# EAGLE design waterius-homemade_heat_counter (EAGLE 9.6.2)
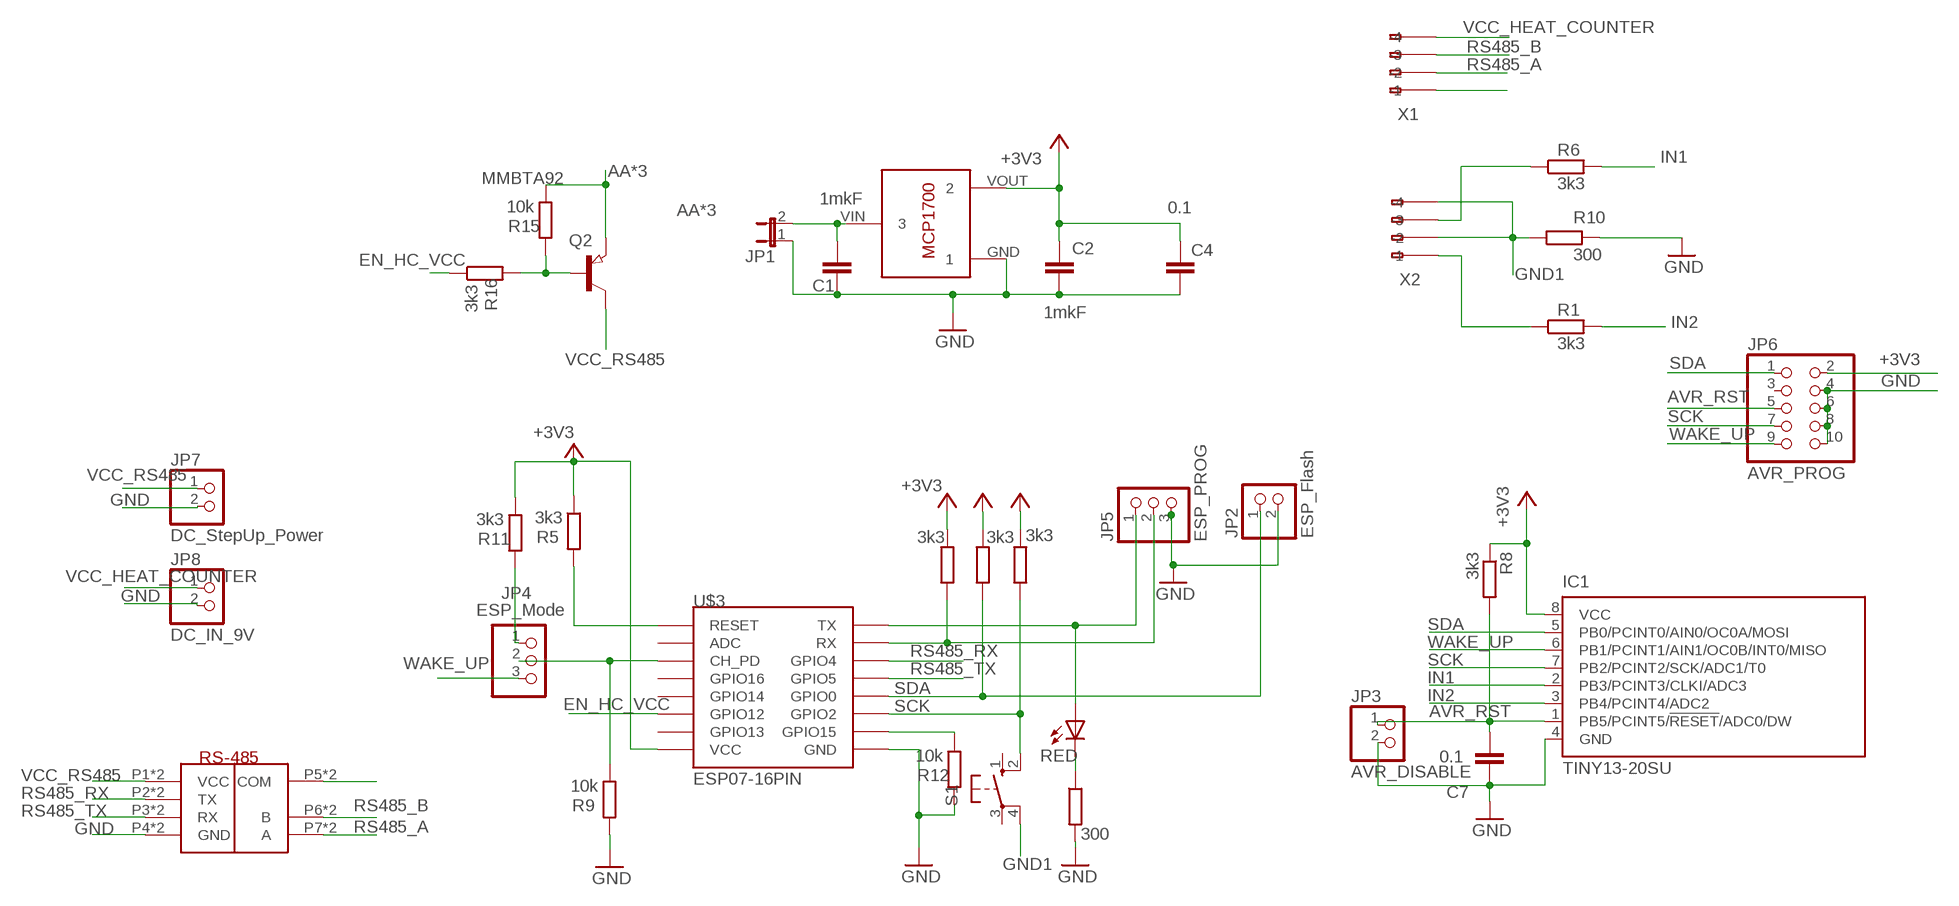
[diagram p0: schematic, sheet 1]

## Parts
C1  1mkF  C-EUC0805  [C0805]
C2  1mkF  C-EUC0805  [C0805]
C4  0.1  C-EUC0805  [C0805]
C7  0.1  C-EUC0805  [C0805]
IC1  TINY13-20SU  [8S2]
JP1  JP1E  [JP1]
JP2  ESP_Flash  PINHD-1X2  [1X02]
JP3  AVR_DISABLE  PINHD-1X2  [1X02]
JP4  ESP_Mode  PINHD-1X3  [1X03]
JP5  ESP_PROG  PINHD-1X3  [1X03]
JP6  AVR_PROG  PINHD-2X5  [2X05]
JP7  DC_StepUp_Power  PINHD-1X2  [1X02]
JP8  DC_IN_9V  PINHD-1X2  [1X02]
LED1  RED  LEDCHIPLED_0805  [CHIPLED_0805]
Q2  MMBTA92  PNP-TRANSISTOR_SOT23  [SOT23]
R1  3k3  R-EU_M0805  [M0805]
R2  3k3  R-EU_R0805  [R0805]
R3  3k3  R-EU_R0805  [R0805]
R4  300  R-EU_R0805  [R0805]
R5  3k3  R-EU_R0805  [R0805]
R6  3k3  R-EU_M0805  [M0805]
R7  3k3  R-EU_R0805  [R0805]
R8  3k3  R-EU_R0805  [R0805]
R9  10k  R-EU_R0805  [R0805]
R10  300  R-EU_M0805  [M0805]
R11  3k3  R-EU_R0805  [R0805]
R12  10k  R-EU_R0805  [R0805]
R15  10k  R-EU_R0805  [R0805]
R16  3k3  R-EU_R0805  [R0805]
S1  10-XX  [B3F-10XX]
U1  RS-485-MODULE  [DIP_MODULE]
U$2  MCP1700T-3302E/TT  [MCP1700T-3302E/TT]
U$3  ESP07-16PIN  [ESP07-16PIN]
X1  233-104  [233-104]
X2  233-104  [233-104]

## Nets
+3V3: C2.1 C4.1 IC1.8(VCC) JP6.2 R2.1 R3.1 R5.1 R7.1 R8.1 R11.1 U$2.VOUT U$3.VCC
AA*3: C1.1 JP1.2 Q2.2(E) R15.1 U$2.VIN
AVR_RST: C7.2 IC1.1(PB5/PCINT5/!RESET!/ADC0/DW) JP3.1 JP6.5 R8.2
EN_HC_VCC: R16.1 U$3.GPIO12
GND: C1.2 C2.2 C4.2 C7.1 IC1.4(GND) JP1.1 JP2.2 JP3.2 JP5.3 JP6.4 JP6.6 JP6.8 JP6.10 JP7.2 JP8.2 R4.2 R9.2 R10.2 R12.2 U1.P4(GND) U1.P13(GND) U$2.GND U$3.GND
GND1: R10.1 S1.4(P1) X2.A2(-2) X2.A4(-4)
IN1: IC1.2(PB3/PCINT3/CLKI/ADC3) R6.2
IN2: IC1.3(PB4/PCINT4/ADC2) R1.2
N$1: JP5.1 LED1.A U$3.TX
N$2: R5.2 U$3.REST(RESET)
N$3: R6.1 X2.A3(-3)
N$4: R1.1 X2.A1(-1)
N$5: JP5.2 R7.2 U$3.RX
N$6: LED1.C R4.1
N$7: JP4.2 R9.1 U$3.CH_PD
N$8: JP4.1 R11.2
N$9: R12.1 U$3.GPIO15
N$13: Q2.1(B) R15.2 R16.2
N$15: X1.A1(-1)
N$16: U1.P5(COM) U1.P14(COM)
RS485_A: U1.P7(A) U1.P8(A) X1.A2(-2)
RS485_B: U1.P6(B) U1.P9(B) X1.A3(-3)
RS485_RX: U1.P2(TX) U1.P11(TX) U$3.GPIO4
RS485_TX: U1.P3(RX) U1.P12(RX) U$3.GPIO5
SCK: IC1.7(PB2/PCINT2/SCK/ADC1/T0) JP6.7 R2.2 S1.2(S1) U$3.GPIO2
SDA: IC1.5(PB0/PCINT0/AIN0/OC0A/MOSI) JP2.1 JP6.1 R3.2 U$3.GPIO0
VCC_HEAT_COUNTER: JP8.1 X1.A4(-4)
VCC_RS485: JP7.1 Q2.3(C) U1.P1(VCC) U1.P10(VCC)
WAKE_UP: IC1.6(PB1/PCINT1/AIN1/OC0B/INT0/MISO) JP4.3 JP6.9
Unconnected: JP6.3 S1.1(S) S1.3(P) U$3.ADC U$3.GPIO13 U$3.GPIO14 U$3.GPIO16 X1.B1(B-1) X1.B2(B-2) X1.B3(B-3) X1.B4(B-4) X2.B1(B-1) X2.B2(B-2) X2.B3(B-3) X2.B4(B-4)

## Library data of the parts
C1 C2 C7 = resistor:C-EU: CAPACITOR, European symbol
C4 = rcl:C-EU: CAPACITOR, European symbol; SPICEPREFIX: C
IC1 = atmel:TINY13: 8-bit AVR Microcontroller with 1K Bytes In-System Programmable Flash Source: http://www.atmel.com/dyn/resources/prod_documents/2535S.pdf; MPN: ATTINY13-20SU; OC_FARNELL: 9171568; OC_NEWARK: 96K6522
JP1 = jumper:JP1E: JUMPER
JP2 JP3 JP7 JP8 = pinhead:PINHD-1X2: PIN HEADER
JP4 JP5 = pinhead:PINHD-1X3: PIN HEADER
JP6 = pinhead:PINHD-2X5: PIN HEADER
LED1 = led:LED: LED OSRAM: - CHIPLED LG R971, LG N971, LY N971, LG Q971, LY Q971, LO R971, LY R971 LH N974, LH R974 LS Q976, LO Q976, LY Q976 LO Q996 - Hyper CHIPLED LW Q18S LB Q993, LB Q99A, LB R99A - SideLED LS A670, LO A670, LY A670, LG A670, LP A670 LB A673, LV A673, LT A673, LW A673 LH A674 LY A675 LS A676, LA A676, LO A676, LY A676, LW A676 LS A679, LY A679, LG A679 - Hyper Micro SIDELED® LS Y876, LA Y876, LO Y876, LY Y876 LT Y87S - SmartLED LW L88C, LW L88S LB L89C, LB L89S, LG L890 LS L89K, LO L89K, LY L89K LS L896, LA L896, LO L896, LY L896 - TOPLED LS T670, LO T670, LY T670, LG T670, LP T670 LSG T670, LSP T670, LSY T670, LOP T670, LYG T670 LG T671, LOG T671, LSG T671 LB T673, LV T673, LT T673, LW T673 LH T674 LS T676, LA T676, LO T676, LY T676, LB T676, LH T676, LSB T676, LW T676 LB T67C, LV T67C, LT T67C, LS T67K, LO T67K, LY T67K, LW E67C LS E67B, LA E67B, LO E67B, LY E67B, LB E67C, LV E67C, LT E67C LW T67C LS T679, LY T679, LG T679 LS T770, LO T770, LY T770, LG T770, LP T770 LB T773, LV T773, LT T773, LW T773 LH T774 LS E675, LA E675, LY E675, LS T675 LS T776, LA T776, LO T776, LY T776, LB T776 LHGB T686 LT T68C, LB T68C - Hyper Mini TOPLED® LB M676 - Mini TOPLED Santana® LG M470 LS M47K, LO M47K, LY M47K Source: http://www.osram.convergy.de LUXEON: - LUMILED® LXK2-PW12-R00, LXK2-PW12-S00, LXK2-PW14-U00, LXK2-PW14-V00 LXK2-PM12-R00, LXK2-PM12-S00, LXK2-PM14-U00 LXK2-PE12-Q00, LXK2-PE12-R00, LXK2-PE12-S00, LXK2-PE14-T00, LXK2-PE14-U00 LXK2-PB12-K00, LXK2-PB12-L00, LXK2-PB12-M00, LXK2-PB14-N00, LXK2-PB14-P00, LXK2-PB14-Q00 LXK2-PR12-L00, LXK2-PR12-M00, LXK2-PR14-Q00, LXK2-PR14-R00 LXK2-PD12-Q00, LXK2-PD12-R00, LXK2-PD12-S00 LXK2-PH12-R00, LXK2-PH12-S00 LXK2-PL12-P00, LXK2-PL12-Q00, LXK2-PL12-R00 Source: www.luxeon.com KINGBRIGHT: KA-3528ASYC Source: www.kingbright.com
Q2 = semicon-smd-ipc:PNP-TRANSISTOR_: PNP TRANSISTOR
R1 = resistor:R-EU_: RESISTOR, European symbol; SPICEPREFIX: R
R2 R5 R7 R9 R11 R12 R15 R16 = rcl:R-EU_: RESISTOR, European symbol; OM: 3k6
R3 R8 = rcl:R-EU_: RESISTOR, European symbol; OM: 3k6; SPICEPREFIX: R
R4 = rcl:R-EU_: RESISTOR, European symbol; OM: 200; SPICEPREFIX: R
R6 R10 = resistor:R-EU_: RESISTOR, European symbol
S1 = switch-omron:10-XX: OMRON SWITCH; MPN: B3F-1000; OC_FARNELL: 176432; OC_NEWARK: 36M3542
U1 = RS485Module:RS-485-MODULE
U$2 = MCP1700T-3302E_TT:MCP1700T-3302E/TT: Microchip LDO "MCP1700" in a 3-Pin SOT-23 package. ID: MCP1700T-3302E/TT
U$3 = esp8266modules:ESP07-16PIN: ESP8266 Wifi module 07 - 16 pins; DIMENSIONS: 22.0 x 16.0 mm; PINS: 16; PITCH: 0.078" / 2 mm
X1 X2 = con-wago255:233-104: WAGO; MPN: 233-104; OC_FARNELL: unknown; OC_NEWARK: 28K9046

## Board
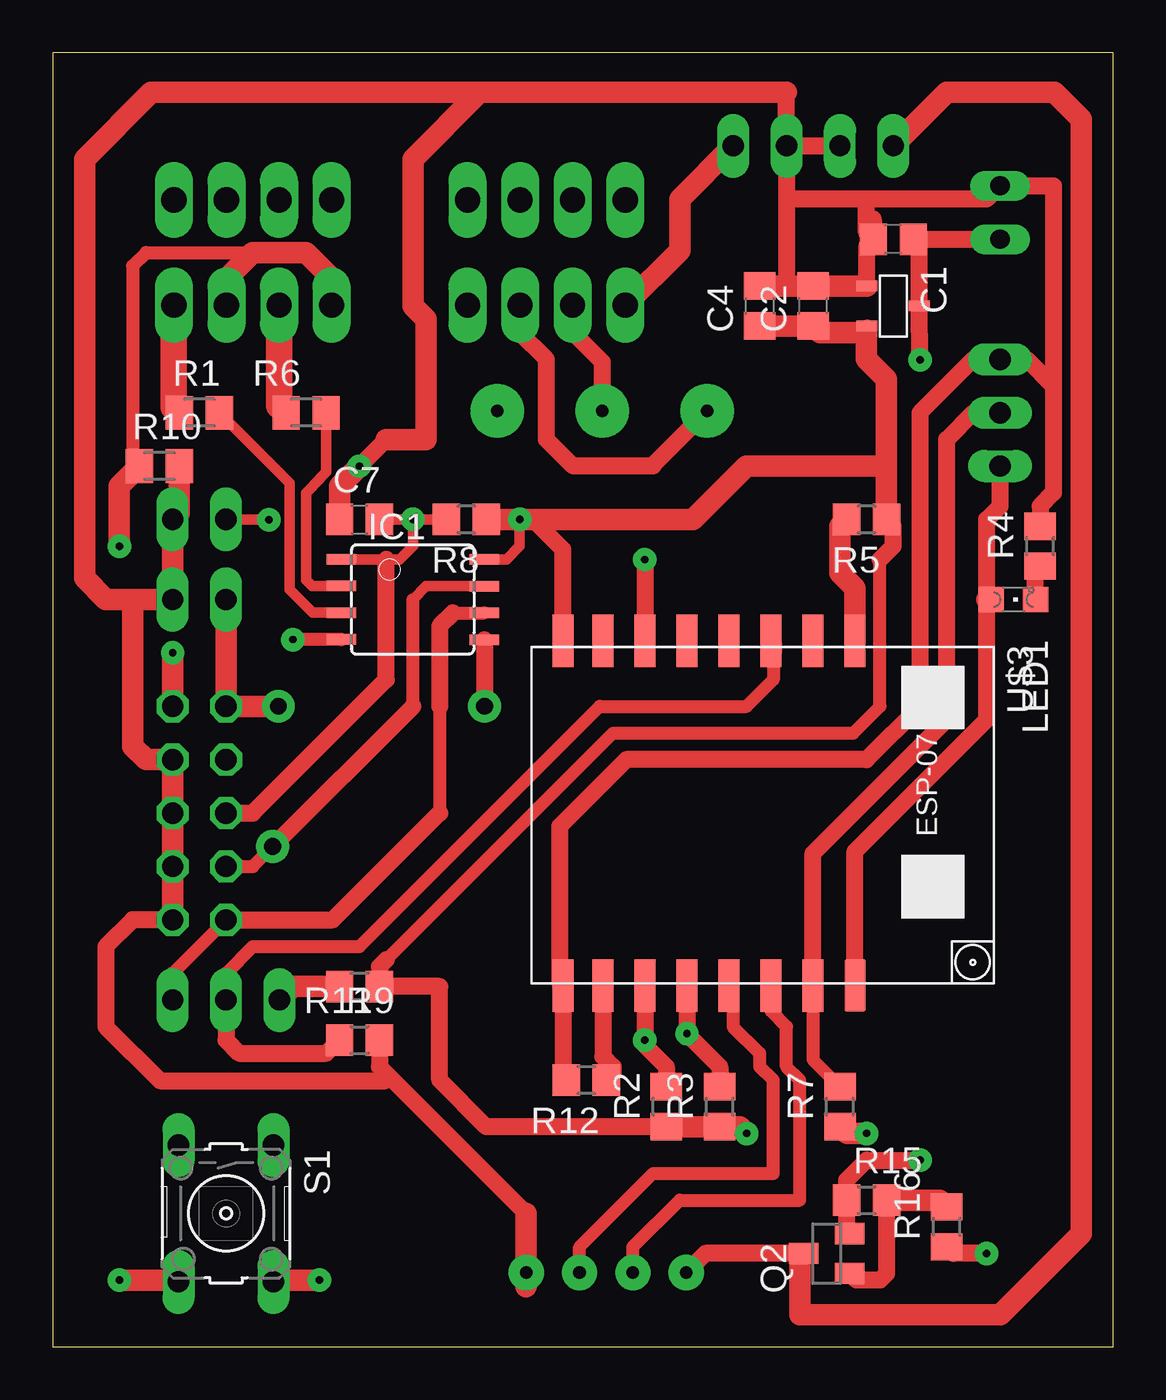
[diagram p1: board, top side]
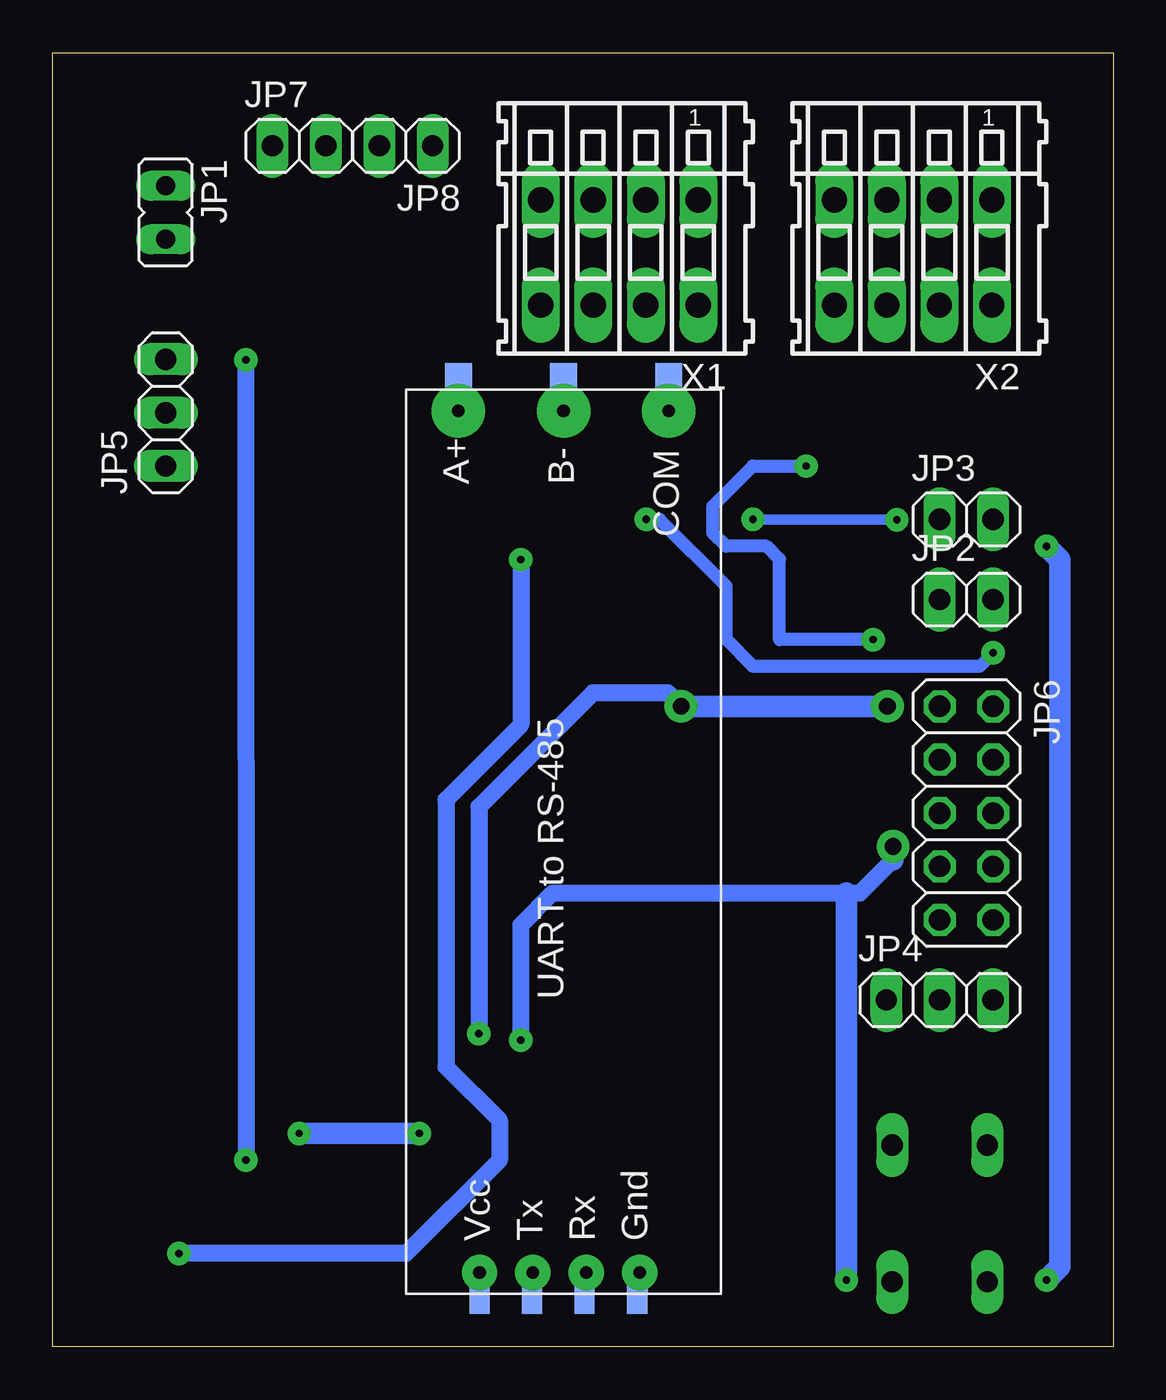
[diagram p2: board, bottom side, seen from below]

Size 50.47 x 61.58 mm. Coordinates in mm from the lower left corner, seen from the top.
Outline: 0,0 50.47,0 50.47,61.58 0,61.58 0,0
Copper layers (1*16): Top 0.035mm / dielectric 1.5mm / Bottom 0.035mm
Design rules "default *": minimum track width 6mil, minimum drill 0.35mm, track to track 6mil, track to pad 6mil, pad to pad 6mil, via to via 6mil, smd to smd 6mil, copper to edge 40mil, drill to drill 6mil, minimum pad ring 10mil, minimum via ring 15mil, stop-mask expansion 4mil, vias tented up to drill 0mil, thermal gap 10mil

### Footprints (pad centres in the part's own frame; a part is rotated, then mirrored left to right if it is on the bottom)
C0805 = smd 1.3 x 1.5: 1 -0.95,0; 2 0.95,0
8S2 = smd 0.5 x 1.4: 1 -1.905,-3.404; 2 -0.645,-3.404; 3 0.625,-3.404; 4 1.895,-3.404; 5 1.905,3.404; 6 0.635,3.404; 7 -0.635,3.404; 8 -1.905,3.404
JP1 = drill 0.914 long: 1 0,-1.27; 2 0,1.27
1X02 = drill 1.016 long: 1 -1.27,0; 2 1.27,0
1X03 = drill 1.016 long: 1 -2.54,0; 2 0,0; 3 2.54,0
2X05 = drill 1.016 octagon: 1 -5.08,-1.27; 2 -5.08,1.27; 3 -2.54,-1.27; 4 -2.54,1.27; 5 0,-1.27; 6 0,1.27; 7 2.54,-1.27; 8 2.54,1.27; 9 5.08,-1.27; 10 5.08,1.27
CHIPLED_0805 = smd 1.2 x 1.2: A 0,-1.05; C 0,1.05
SOT23 = smd 1 x 1.4: 1 -0.95,-1.1; 2 0.95,-1.1; 3 0,1.1
M0805 = smd 1.3 x 1.6: 1 -0.95,0; 2 0.95,0
R0805 = smd 1.3 x 1.5: 1 -0.95,0; 2 0.95,0
B3F-10XX = drill 1.016 long: 1 -3.251,2.261; 2 3.251,2.261; 3 -3.251,-2.261; 4 3.251,-2.261
DIP_MODULE = smd 1.93 x 0.965: P1 0,-3.5; P2 0,-6; P3 0,-8.5; P4 0,-11 | drill 0.6 pad 2.54: P5 42,-12.5; P6 42,-7.5; P7 42,-2.5 | smd 2.54 x 1.27: P8 43,-2.5; P9 43,-7.5; P14 43,-12.5 | drill 0.6 pad 1.676: P10 1,-3.5; P11 1,-6.04; P12 1,-8.58; P13 1,-11.12
MCP1700T-3302E/TT = smd 0.5 x 1: GND -0.95,-1.25; VIN 0,1.25; VOUT 0.95,-1.25
ESP07-16PIN = smd 2.5 x 1: ADC -8.2,3.8; CH_PD -8.2,1.8; GND 8.2,-8.105; GPIO0 8.2,-2.2; GPIO2 8.2,-4.2; GPIO4 8.2,1.8; GPIO5 8.2,-0.2; GPIO12 -8.2,-4.2; GPIO13 -8.2,-6.2; GPIO14 -8.2,-2.2; GPIO15 8.2,-6.2; GPIO16 -8.2,-0.2; REST -8.2,5.8; RX 8.2,3.8; TX 8.2,5.8; VCC -8.2,-8.105
233-104 = drill 1.2 long: A1 -3.75,2.5; A2 -1.25,2.5; A3 1.25,2.5; A4 3.75,2.5; B1 -3.75,-2.5; B2 -1.25,-2.5; B3 1.25,-2.5; B4 3.75,-2.5

### Placement (x,y rotation side)
C1  40.01,52.7 180 top
C2  36.2,49.53 90 top
C4  33.66,49.53 90 top
C7  14.61,39.37 0 top
IC1  17.14,35.56 270 top
JP1  45.09,53.97 180 bottom
JP2  6.99,35.56 0 bottom
JP3  6.99,39.37 0 bottom
JP4  8.25,16.51 0 bottom
JP5  45.09,44.45 90 bottom
JP6  6.99,25.4 270 bottom
JP7  38.73,57.15 0 bottom
JP8  33.66,57.15 180 bottom
LED1  45.72,35.56 270 top
Q2  36.83,4.44 90 top
R1  6.99,44.45 0 top
R2  29.21,11.43 90 top
R3  31.75,11.43 90 top
R4  46.99,38.1 90 top
R5  38.73,39.37 180 top
R6  12.07,44.45 0 top
R7  37.47,11.43 90 top
R8  19.68,39.37 180 top
R9  14.61,14.6 0 top
R10  5.08,41.91 0 top
R11  14.61,17.14 180 top
R12  25.4,12.7 180 top
R15  38.73,6.98 0 top
R16  42.55,5.71 90 top
S1  8.25,6.35 270 top
U1  33.66,2.54 90 bottom
U$2  40.01,49.53 270 top
U$3  32.39,25.4 270 top
X1  23.5,52.07 180 bottom
X2  9.52,52.07 180 bottom

### Tracks (layer width: path | path; a pad name or v marks a point on that pad's centre or on a via)
+3V3  (via drill 0.35)
  Top 0.508: IC1.8 21.59,37.47 22.22,38.1 v22.22,39.37
  Top 0.61: U$2.VOUT 38.73,48.56 38.73,48.26 | 15.88,18.41 26.67,29.21 38.1,29.21 39.37,30.48 39.37,37.47
  Top 0.813: U$3.VCC 24.28,37.95 22.86,39.37 v22.22,39.37 | 39.37,37.47 40.01,38.1 40.01,39.05 R5.1 | 15.88,18.41 15.55,18.09 R11.1 18.41,17.14 18.41,12.7 20.63,10.48 R2.1
  Top 1.016: C4.1 C2.1 36.52,48.26 38.73,48.26 38.73,46.99 39.69,46.04 39.69,41.91 | JP6.2 v5.72,33.02 | R8.1 v22.22,39.37 30.48,39.37 33.02,41.91 39.69,41.91 | R2.1 R3.1 32.7,10.48 v33.02,10.16 | v38.73,10.16 37.79,10.16 R7.1 | R5.1 39.69,41.91
  Bottom 0.61: v5.72,33.02 6.35,32.39 17.14,32.39 18.41,33.66 18.41,36.19 21.59,39.37 v22.22,39.37
  Bottom 1.016: v33.02,10.16 v38.73,10.16
AA*3  (via drill 0.35)
  Top 0.813: Q2.2 37.79,5.54 R15.1 37.79,7.94 38.73,8.89 v41.28,8.89 | v41.28,46.97 U$2.VIN 41.26,52.41 C1.1 JP1.2
  Bottom 0.813: v41.28,46.97 41.26,8.91 v41.28,8.89
AVR_RST  (via drill 0.35)
  Top 0.508: IC1.1 15.88,37.47 16.51,37.47 17.14,38.1 v17.14,39.37 | v17.14,39.37 C7.2 | R8.2 v17.14,39.37 | v10.29,39.36 8.27,39.36 JP3.1
  Top 0.813: JP6.5 9.52,25.4 15.88,31.75 15.88,37.47
  Bottom 0.508: v17.14,39.37 v10.31,39.37 v10.29,39.36
EN_HC_VCC  (via drill 0.35)
  Top 0.813: v28.18,37.47 U$3.GPIO12 | v44.45,4.44 42.87,4.44 R16.1
  Bottom 0.813: v28.18,37.47 28.18,29.6 31.75,26.04 31.75,13.33 29.21,10.79 29.21,8.89 33.66,4.44 v44.45,4.44
GND  (via drill 0.35)
  Top 0.61: IC1.4 13.73,33.66 v11.43,33.66
  Top 0.813: 15.88,43.18 v14.61,41.91 | JP6.10 3.81,20.32 2.54,19.05 2.54,15.24 5.12,12.66 15.84,12.66 16.03,12.85 | 16.03,12.85 15.55,13.33 15.55,13.34 R9.2 | 16.03,12.85 22.54,6.35 | R12.2 24.28,12.87 U$3.GND 24.13,17.35 24.13,24.76 27.3,27.94 38.73,27.94 41.28,30.48 41.28,44.45 43.82,46.99 JP5.3 46.36,46.99 47.62,45.72 | 47.62,45.72 47.62,45.08 47.62,40.64 46.99,40 R4.2 | U$2.GND 38.76,52.41 C1.2 | 39.05,53.66 C1.2 | JP8.2 34.93,54.61 | 34.93,54.61 34.93,50.48 | JP8.2 34.93,59.69 | JP8.2 JP7.2 | 38.73,54.61 44.45,54.61 JP1.1 47.62,55.24 47.62,45.72 | 38.73,54.61 34.93,54.61 | C1.2 38.73,53.02 38.73,54.61
  Top 1.016: C4.2 34.93,50.48 C2.2 U$2.GND 38.73,50.5 | JP8.2 34.93,58.16 | C7.1 13.65,40.96 v14.61,41.91 | JP6.10 JP6.8 JP6.6 JP6.4 4.45,27.94 3.81,28.57 3.81,35.56 | 34.93,59.69 20.32,59.69 | 20.32,59.69 17.14,56.52 17.14,49.53 17.78,48.89 17.78,43.18 15.88,43.18 | 22.54,6.35 U1.P13 22.54,2.86 | 20.32,59.69 4.7,59.69 1.52,56.52 1.52,36.58 2.54,35.56 3.81,35.56 | R10.2 6.03,39.69 JP3.2 JP2.2 3.81,35.56
  Bottom 0.61: v14.61,41.91 17.14,41.91 19.05,40 19.05,38.73 18.41,38.1 16.51,38.1 15.88,37.47 15.88,33.66 v11.43,33.66
  Bottom 0.813: U1.P4 22.54,2.66 U1.P13
GND1  (via drill 0.35)
  Top 0.61: 9.52,52.07 4.45,52.07 3.81,51.43 3.81,42.23 R10.1
  Top 0.813: 8.25,49.59 8.25,50.8
  Top 1.016: X2.A4 13.34,49.63 13.34,50.8 12.07,52.07 9.52,52.07 8.25,50.8 | X2.A2 8.25,49.59 | v3.17,38.1 3.17,40.95 R10.1 | v3.17,3.17 5.92,3.17 S1.4
  Bottom 1.016: v3.17,38.1 2.54,37.47 2.54,3.81 v3.17,3.17
IN1
  Top 0.508: R6.2 13.02,41.61 12.74,41.34 12.74,41.32 12.06,40.63 12.06,36.49 12.34,36.2 IC1.2
IN2
  Top 0.508: IC1.3 12.38,34.94 11.28,36.03 11.28,41.1 R1.2
N$1
  Top 0.813: JP5.1 45.09,40 44.45,39.37 44.45,35.56 44.45,29.84 38.19,23.58 U$3.TX 38.19,17.06
  Top 1.016: LED1.A 44.45,35.56
N$2
  Top 1.016: U$3.REST 38.19,36.11 37.47,36.83 37.47,39.05 R5.2
N$3
  Top 1.27: R6.1 10.77,44.79 X2.A3
N$4
  Top 1.27: X2.A1 5.77,44.71 R1.1
N$5
  Top 0.61: U$3.RX 36.19,13.66 R7.2
  Top 0.813: U$3.RX 36.19,23.48 42.55,29.84 42.55,43.18 43.82,44.45 JP5.2
N$6
  Top 0.813: LED1.C 46.77,36.93 R4.1
N$7
  Top 0.61: JP4.2 8.25,17.78 9.52,19.05 14.61,19.05 26.04,30.48 33.02,30.48 34.29,31.75 34.29,33.02
  Top 0.813: U$3.CH_PD 34.29,33.5 34.29,33.02 | JP4.2 8.25,14.6 8.89,13.97 13.02,13.97 R9.1
N$8
  Top 1.016: R11.2 11.43,17.14 JP4.1
N$9
  Top 0.813: U$3.GPIO15 26.18,13.82 26.67,13.33 26.67,13.02 R12.1
N$13
  Top 0.813: R15.2 39.69,3.49 39.37,3.17 38.25,3.17 Q2.1
  Top 1.016: R15.2 42.23,6.98 R16.2
N$16
  Bottom 0.61: U1.P14 U1.P5
RS485_A
  Top 0.813: U1.P7 28.57,41.96 28.57,41.91 24.77,41.91 23.5,43.18 23.5,46.99 22.22,48.26 22.22,49.55 X1.A2
  Bottom 0.61: U1.P8 U1.P7
RS485_B
  Top 0.813: U1.P6 26.15,46.87 24.77,48.26 24.77,49.55 X1.A3
  Bottom 0.61: U1.P9 U1.P6
RS485_RX
  Top 0.61: U1.P11 27.61,4.75 29.85,6.98 35.56,6.98 35.56,12.7 34.93,13.33 34.93,15.24 34.19,15.98 U$3.GPIO4
  Bottom 0.61: U1.P2 27.61,2.58 U1.P11
RS485_TX
  Top 0.61: U$3.GPIO5 32.39,17 32.39,15.24 33.66,13.97 33.66,13.33 34.29,12.7 34.29,8.25 28.57,8.25 25.07,4.75 U1.P12
  Bottom 0.61: U1.P3 25.07,2.62 U1.P12
SCK  (via drill 0.35, 0.8)
  Top 0.508: 17.14,35.56 17.78,36.19 IC1.7
  Top 0.61: JP6.7 9.52,22.86 v10.48,23.81 | 17.14,30.48 17.14,35.56 | v28.18,14.6 28.18,14.36
  Top 0.813: v10.48,23.81 17.14,30.48 | U$3.GPIO2 v28.18,14.6 | 28.18,14.36 29.21,13.33 R2.2
  Top 1.016: S1.2 10.59,3.17 v12.7,3.17
  Bottom 0.813: v28.18,14.6 28.18,20.07 26.67,21.59 12.7,21.59 12.07,21.59 10.48,23.18
  Bottom 1.016: 10.48,23.18 v10.48,23.81 | v12.7,3.17 12.7,21.59
SDA  (via drill 0.35, 0.8)
  Top 0.61: 20.55,30.49 v20.56,30.48
  Top 0.813: U$3.GPIO0 v30.18,14.9 31.75,13.33 R3.2 | IC1.5 20.55,30.49
  Top 1.016: JP2.1 JP6.1 v10.74,30.48
  Bottom 0.813: v20.56,30.48 21.2,31.11 24.77,31.11 30.18,25.69 v30.18,14.9
  Bottom 1.016: v10.74,30.48 v20.56,30.48
VCC_HEAT_COUNTER
  Top 1.016: X1.A4 29.85,52.17 29.85,54.61 JP8.1
VCC_RS485
  Top 0.813: Q2.3 31.06,4.44 U1.P10
  Top 1.016: JP7.1 42.55,59.69 47.68,59.69 48.95,58.42 48.95,5.38 45.09,1.52 35.56,1.52 35.56,4.27 Q2.3
  Bottom 0.61: U1.P1 U1.P10
WAKE_UP
  Top 0.61: 19.05,34.92 IC1.6 | 18.41,30.48 18.41,25.4 | JP6.9 5.72,17.78 JP4.3
  Top 0.813: 18.41,30.48 18.41,34.29 19.05,34.92 | JP6.9 13.34,20.32 18.41,25.4